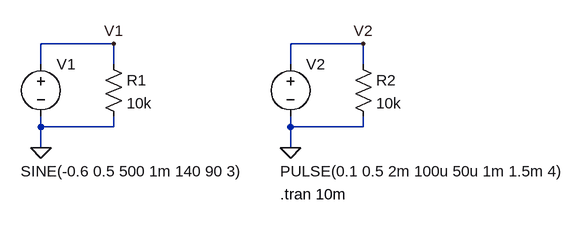
[diagram p0: schematic Pulse_Params.asc]
Pulse_Params.asc, the LTspice schematic file:
Version 4
SHEET 1 948 680
WIRE 192 96 80 96
WIRE 576 96 464 96
WIRE 80 128 80 96
WIRE 192 128 192 96
WIRE 464 128 464 96
WIRE 576 128 576 96
WIRE 80 224 80 208
WIRE 192 224 192 208
WIRE 192 224 80 224
WIRE 464 224 464 208
WIRE 576 224 576 208
WIRE 576 224 464 224
WIRE 80 256 80 224
WIRE 464 256 464 224
FLAG 80 256 0
FLAG 464 256 0
FLAG 192 96 V1
FLAG 576 96 V2
SYMBOL voltage 80 112 R0
WINDOW 3 -31 180 Left 2
WINDOW 123 0 0 Left 0
WINDOW 39 0 0 Left 0
SYMATTR InstName V1
SYMATTR Value SINE(-0.6 0.5 500 1m 140 90 3)
SYMBOL voltage 464 112 R0
WINDOW 3 -16 180 Left 2
WINDOW 123 0 0 Left 0
WINDOW 39 0 0 Left 0
SYMATTR InstName V2
SYMATTR Value PULSE(0.1 0.5 2m 100u 50u 1m 1.5m 4)
SYMBOL res 176 112 R0
SYMATTR InstName R1
SYMATTR Value 10k
SYMBOL res 560 112 R0
SYMATTR InstName R2
SYMATTR Value 10k
TEXT 448 328 Left 2 !.tran 10m

The netlist it stands for:
* Pulse_Params.asc
V1 V1 0 SINE(-0.6 0.5 500 1m 140 90 3)
V2 V2 0 PULSE(0.1 0.5 2m 100u 50u 1m 1.5m 4)
R1 V1 0 10k
R2 V2 0 10k
.tran 10m
.backanno
.end